# EAGLE schematic Flipper_WiFi_Dev_Board_v6 (EAGLE 9.7.0)
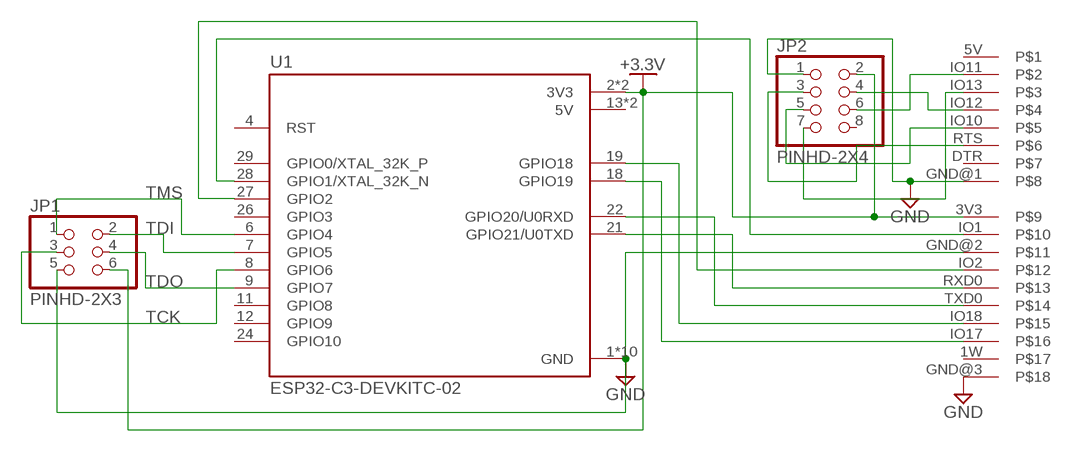
[diagram p0: schematic, sheet 1]

## Parts
JP1  PINHD-2X3  [2X03]
JP2  PINHD-2X4  [2X04]
U1  ESP32-C3-DEVKITC-02  [XCVR_ESP32-C3-DEVKITC-02]
U$1  FLIPPER_DEVBOARD  [FLIPPER]

## Nets
+3.3V: JP1.6 JP2.2 U1.2(3V3) U1.3(3V3) U$1.3V3
GND: JP1.5 JP2.1 U1.1(GND) U1.5(GND) U1.10(GND) U1.15(GND) U1.16(GND) U1.17(GND) U1.20(GND) U1.23(GND) U1.25(GND) U1.30(GND) U$1.GND@1 U$1.GND@2 U$1.GND@3
N$1: U1.21(GPIO21/U0TXD) U$1.RXD0
N$2: U1.22(GPIO20/U0RXD) U$1.TXD0
N$3: U1.28(GPIO1/XTAL_32K_N) U$1.IO1
N$4: U1.27(GPIO2) U$1.IO2
N$5: U1.19(GPIO18) U$1.IO18
N$6: U1.18(GPIO19) U$1.IO17
N$10: JP2.3 U$1.RTS
N$11: JP2.4 U$1.IO12
N$12: JP2.5 U$1.IO10
N$13: JP2.6 U$1.IO11
N$14: JP2.7 U$1.IO13
TCK: JP1.3 U1.8(GPIO6)
TDI: JP1.2 U1.7(GPIO5)
TDO: JP1.4 U1.9(GPIO7)
TMS: JP1.1 U1.6(GPIO4)
Unconnected: JP2.8 U1.4(RST) U1.11(GPIO8) U1.12(GPIO9) U1.24(GPIO10) U1.26(GPIO3) U1.29(GPIO0/XTAL_32K_P) U$1.1W U$1.5V U$1.DTR

## Power pins joined to a net without a drawn wire
5V: U1.13(5V) U1.14(5V)

## Library data of the parts
JP1 = Connector:PINHD-2X3: PIN HEADER; CATEGORY: Headers; DESCRIPTION: Header, Straight, 2x3 Position; MANUFACTURER: Generic; MPN: Generic; OPERATING_TEMPERATURE: Generic; PART_STATUS: Active; PITCH: 0.100" (2.54mm); ROHS_COMPLIANCE: Generic; SERIES: Generic; SUB-CATEGORY: Headers, Male Pins; TYPE: Board to Board or Cable, Unshrouded, Through Hole, Straight
JP2 = Connector:PINHD-2X4: PIN HEADER; CATEGORY: Headers; DESCRIPTION: Header, Straight, 2x4 Position; MANUFACTURER: Generic; MPN: Generic; OPERATING_TEMPERATURE: Generic; PART_STATUS: Active; PITCH: 0.100" (2.54mm); ROHS_COMPLIANCE: Generic; SERIES: Generic; SUB-CATEGORY: Headers, Male Pins; TYPE: Board to Board or Cable, Unshrouded, Through Hole, Straight
U1 = ESP32-C3-DEVKITC-02:ESP32-C3-DEVKITC-02: Check availability <https://pricing.snapeda.com/parts/ESP32-C3-DevKitC-02/Espressif%20Systems/view-part?ref=eda>; AVAILABILITY: In Stock; CHECK_PRICES: https://www.snapeda.com/parts/ESP32-C3-DevKitC-02/Espressif+Systems/view-part/?ref=eda; DESCRIPTION: Development Boards & Kits - Wireless (Engineering Samples) ESP32-C3 General-Purpose Development Board, embeds ESP32-C3-WROOM-02, 4 MB Flash, with Pin Header; MF: Espressif Systems; MP: ESP32-C3-DevKitC-02; PACKAGE: None; PRICE: None; PURCHASE-URL: https://www.snapeda.com/api/url_track_click_mouser/?unipart_id=5812307&manufacturer=Espressif Systems&part_name=ESP32-C3-DevKitC-02&search_term=esp32-c3-devkit; SNAPEDA_LINK: https://www.snapeda.com/parts/ESP32-C3-DevKitC-02/Espressif+Systems/view-part/?ref=snap
U$1 = Flipper_DevBoard:FLIPPER_DEVBOARD